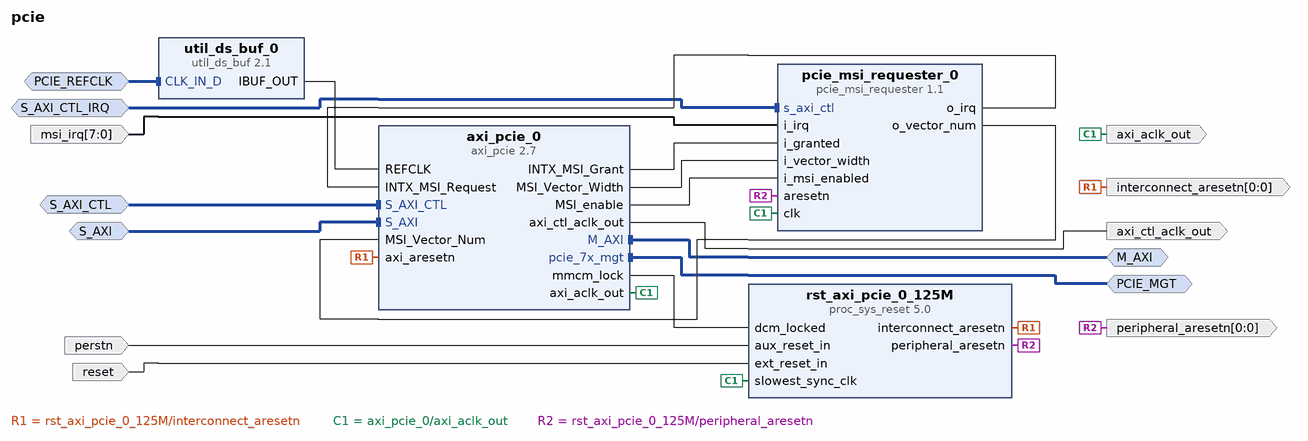
[diagram p0: block diagram of the top level]
# Vivado block design pcie, Vivado 2015.4.1
create_bd_design pcie

create_bd_intf_port -mode Slave -vlnv xilinx.com:interface:diff_clock_rtl:1.0 PCIE_REFCLK
create_bd_intf_port -mode Slave -vlnv xilinx.com:interface:aximm_rtl:1.0 S_AXI_CTL
set_property -dict [list \
  CONFIG.DATA_WIDTH 32 \
  CONFIG.PROTOCOL AXI4LITE \
  CONFIG.ID_WIDTH 0 \
  CONFIG.ADDR_WIDTH 28 \
  CONFIG.AWUSER_WIDTH 0 \
  CONFIG.ARUSER_WIDTH 0 \
  CONFIG.WUSER_WIDTH 0 \
  CONFIG.RUSER_WIDTH 0 \
  CONFIG.BUSER_WIDTH 0 \
  CONFIG.READ_WRITE_MODE READ_WRITE \
  CONFIG.HAS_BURST 0 \
  CONFIG.HAS_LOCK 0 \
  CONFIG.HAS_PROT 0 \
  CONFIG.HAS_CACHE 0 \
  CONFIG.HAS_QOS 0 \
  CONFIG.HAS_REGION 0 \
  CONFIG.HAS_WSTRB 1 \
  CONFIG.HAS_BRESP 1 \
  CONFIG.HAS_RRESP 1 \
  CONFIG.SUPPORTS_NARROW_BURST 0 \
  CONFIG.NUM_READ_OUTSTANDING 4 \
  CONFIG.NUM_WRITE_OUTSTANDING 4 \
  CONFIG.MAX_BURST_LENGTH 1 \
  CONFIG.PHASE 0.000 \
] [get_bd_intf_ports S_AXI_CTL]
create_bd_intf_port -mode Master -vlnv xilinx.com:interface:aximm_rtl:1.0 M_AXI
set_property -dict [list \
  CONFIG.DATA_WIDTH 128 \
  CONFIG.PROTOCOL AXI4 \
  CONFIG.ADDR_WIDTH 32 \
  CONFIG.HAS_QOS 0 \
  CONFIG.HAS_REGION 0 \
  CONFIG.NUM_READ_OUTSTANDING 4 \
  CONFIG.NUM_WRITE_OUTSTANDING 4 \
] [get_bd_intf_ports M_AXI]
create_bd_intf_port -mode Slave -vlnv xilinx.com:interface:aximm_rtl:1.0 S_AXI
set_property -dict [list \
  CONFIG.DATA_WIDTH 128 \
  CONFIG.PROTOCOL AXI4 \
  CONFIG.ID_WIDTH 2 \
  CONFIG.ADDR_WIDTH 32 \
  CONFIG.AWUSER_WIDTH 0 \
  CONFIG.ARUSER_WIDTH 0 \
  CONFIG.WUSER_WIDTH 0 \
  CONFIG.RUSER_WIDTH 0 \
  CONFIG.BUSER_WIDTH 0 \
  CONFIG.READ_WRITE_MODE READ_WRITE \
  CONFIG.HAS_BURST 1 \
  CONFIG.HAS_LOCK 0 \
  CONFIG.HAS_PROT 0 \
  CONFIG.HAS_CACHE 0 \
  CONFIG.HAS_QOS 0 \
  CONFIG.HAS_REGION 1 \
  CONFIG.HAS_WSTRB 1 \
  CONFIG.HAS_BRESP 1 \
  CONFIG.HAS_RRESP 1 \
  CONFIG.SUPPORTS_NARROW_BURST 1 \
  CONFIG.NUM_READ_OUTSTANDING 8 \
  CONFIG.NUM_WRITE_OUTSTANDING 2 \
  CONFIG.MAX_BURST_LENGTH 256 \
] [get_bd_intf_ports S_AXI]
create_bd_intf_port -mode Master -vlnv xilinx.com:interface:pcie_7x_mgt_rtl:1.0 PCIE_MGT
create_bd_intf_port -mode Slave -vlnv xilinx.com:interface:aximm_rtl:1.0 S_AXI_CTL_IRQ
set_property -dict [list \
  CONFIG.DATA_WIDTH 32 \
  CONFIG.PROTOCOL AXI4LITE \
  CONFIG.ID_WIDTH 0 \
  CONFIG.ADDR_WIDTH 16 \
  CONFIG.AWUSER_WIDTH 0 \
  CONFIG.ARUSER_WIDTH 0 \
  CONFIG.WUSER_WIDTH 0 \
  CONFIG.RUSER_WIDTH 0 \
  CONFIG.BUSER_WIDTH 0 \
  CONFIG.READ_WRITE_MODE READ_WRITE \
  CONFIG.HAS_BURST 0 \
  CONFIG.HAS_LOCK 0 \
  CONFIG.HAS_PROT 1 \
  CONFIG.HAS_CACHE 0 \
  CONFIG.HAS_QOS 0 \
  CONFIG.HAS_REGION 0 \
  CONFIG.HAS_WSTRB 1 \
  CONFIG.HAS_BRESP 1 \
  CONFIG.HAS_RRESP 1 \
  CONFIG.SUPPORTS_NARROW_BURST 0 \
  CONFIG.NUM_READ_OUTSTANDING 1 \
  CONFIG.NUM_WRITE_OUTSTANDING 1 \
  CONFIG.MAX_BURST_LENGTH 1 \
] [get_bd_intf_ports S_AXI_CTL_IRQ]
create_bd_port -dir O -from 0 -to 0 -type rst interconnect_aresetn
create_bd_port -dir I -type rst perstn
create_bd_port -dir O -type clk axi_aclk_out
set_property -dict [list \
  CONFIG.ASSOCIATED_BUSIF M_AXI:S_AXI:S_AXI_CTL_IRQ \
  CONFIG.ASSOCIATED_RESET peripheral_aresetn:interconnect_aresetn \
] [get_bd_ports axi_aclk_out]
create_bd_port -dir I -type rst reset
create_bd_port -dir O -from 0 -to 0 -type rst peripheral_aresetn
create_bd_port -dir I -from 7 -to 0 msi_irq
create_bd_port -dir O -type clk axi_ctl_aclk_out
set_property -dict {CONFIG.ASSOCIATED_BUSIF S_AXI_CTL} [get_bd_ports axi_ctl_aclk_out]

create_bd_cell -type ip -vlnv xilinx.com:ip:axi_pcie:2.7 axi_pcie_0
set_property -dict [list \
  CONFIG.NO_OF_LANES X4 \
  CONFIG.MAX_LINK_SPEED 5.0_GT/s \
  CONFIG.DEVICE_ID 0x7022 \
  CONFIG.ENABLE_CLASS_CODE false \
  CONFIG.CLASS_CODE 0x070101 \
  CONFIG.SUB_CLASS_INTERFACE_MENU Bi_directional_parallel_port \
  CONFIG.BAR1_ENABLED false \
  CONFIG.BAR1_TYPE N/A \
  CONFIG.BAR0_SCALE Kilobytes \
  CONFIG.BAR1_SCALE N/A \
  CONFIG.BAR0_SIZE 64 \
  CONFIG.BAR1_SIZE 8 \
  CONFIG.PCIEBAR2AXIBAR_1 0xFFFFFFFF \
  CONFIG.INTERRUPT_PIN false \
  CONFIG.NUM_MSI_REQ 3 \
  CONFIG.COMP_TIMEOUT 50ms \
  CONFIG.AXIBAR2PCIEBAR_0 0x00000000 \
  CONFIG.S_AXI_DATA_WIDTH 128 \
  CONFIG.M_AXI_DATA_WIDTH 128 \
  CONFIG.XLNX_REF_BOARD VC707 \
  CONFIG.PCIE_BLK_LOCN X1Y0 \
  CONFIG.en_transceiver_status_ports false \
] [get_bd_cells axi_pcie_0]
create_bd_cell -type ip -vlnv xilinx.com:ip:proc_sys_reset:5.0 rst_axi_pcie_0_125M
set_property -dict [list \
  CONFIG.C_AUX_RESET_HIGH 0 \
  CONFIG.C_AUX_RST_WIDTH 1 \
  CONFIG.C_EXT_RST_WIDTH 16 \
  CONFIG.USE_BOARD_FLOW true \
  CONFIG.RESET_BOARD_INTERFACE reset \
] [get_bd_cells rst_axi_pcie_0_125M]
create_bd_cell -type ip -vlnv xilinx.com:ip:util_ds_buf:2.1 util_ds_buf_0
set_property -dict {CONFIG.C_BUF_TYPE IBUFDSGTE} [get_bd_cells util_ds_buf_0]
create_bd_cell -type ip -vlnv acs.eonerc.rwth-aachen.de:user:pcie_msi_requester:1.1 pcie_msi_requester_0
set_property -dict {CONFIG.NUM_IRQS 8} [get_bd_cells pcie_msi_requester_0]

# ---- connections ----

connect_bd_intf_net -intf_net pcie_ref_1 [get_bd_intf_ports PCIE_REFCLK] [get_bd_intf_pins util_ds_buf_0/CLK_IN_D]
connect_bd_intf_net -intf_net axi_interconnect_0_M05_AXI [get_bd_intf_ports S_AXI_CTL] [get_bd_intf_pins axi_pcie_0/S_AXI_CTL]
connect_bd_intf_net [get_bd_intf_ports M_AXI] [get_bd_intf_pins axi_pcie_0/M_AXI]
connect_bd_intf_net [get_bd_intf_ports S_AXI] [get_bd_intf_pins axi_pcie_0/S_AXI]
connect_bd_intf_net [get_bd_intf_ports PCIE_MGT] [get_bd_intf_pins axi_pcie_0/pcie_7x_mgt]
connect_bd_intf_net -intf_net s_axi_ctl_1_1 [get_bd_intf_ports S_AXI_CTL_IRQ] [get_bd_intf_pins pcie_msi_requester_0/s_axi_ctl]
connect_bd_net -net S00_ARESETN_1 [get_bd_pins rst_axi_pcie_0_125M/interconnect_aresetn] \
  [get_bd_ports interconnect_aresetn] [get_bd_pins axi_pcie_0/axi_aresetn]
connect_bd_net -net aux_reset_in_1 [get_bd_ports perstn] [get_bd_pins rst_axi_pcie_0_125M/aux_reset_in]
connect_bd_net [get_bd_pins axi_pcie_0/INTX_MSI_Grant] [get_bd_pins pcie_msi_requester_0/i_granted]
connect_bd_net [get_bd_pins axi_pcie_0/MSI_Vector_Width] [get_bd_pins pcie_msi_requester_0/i_vector_width]
connect_bd_net [get_bd_pins axi_pcie_0/MSI_enable] [get_bd_pins pcie_msi_requester_0/i_msi_enabled]
connect_bd_net [get_bd_pins axi_pcie_0/axi_aclk_out] \
  [get_bd_ports axi_aclk_out] [get_bd_pins rst_axi_pcie_0_125M/slowest_sync_clk] [get_bd_pins pcie_msi_requester_0/clk]
connect_bd_net [get_bd_pins axi_pcie_0/mmcm_lock] [get_bd_pins rst_axi_pcie_0_125M/dcm_locked]
connect_bd_net [get_bd_pins pcie_msi_requester_0/o_irq] [get_bd_pins axi_pcie_0/INTX_MSI_Request]
connect_bd_net [get_bd_pins pcie_msi_requester_0/o_vector_num] [get_bd_pins axi_pcie_0/MSI_Vector_Num]
connect_bd_net [get_bd_ports reset] [get_bd_pins rst_axi_pcie_0_125M/ext_reset_in]
connect_bd_net [get_bd_pins rst_axi_pcie_0_125M/peripheral_aresetn] [get_bd_ports peripheral_aresetn] [get_bd_pins pcie_msi_requester_0/aresetn]
connect_bd_net [get_bd_pins util_ds_buf_0/IBUF_OUT] [get_bd_pins axi_pcie_0/REFCLK]
connect_bd_net -net i_irq_1 [get_bd_ports msi_irq] [get_bd_pins pcie_msi_requester_0/i_irq]
connect_bd_net [get_bd_pins axi_pcie_0/axi_ctl_aclk_out] [get_bd_ports axi_ctl_aclk_out]

# ---- address map ----
assign_bd_address -offset 0x00000000 -range 4G -target_address_space [get_bd_addr_spaces axi_pcie_0/M_AXI] [get_bd_addr_segs M_AXI/Reg]
assign_bd_address -offset 0x00000000 -range 4G -target_address_space [get_bd_addr_spaces S_AXI] [get_bd_addr_segs axi_pcie_0/S_AXI/BAR0]
assign_bd_address -offset 0x0000000 -range 256M -target_address_space [get_bd_addr_spaces S_AXI_CTL] [get_bd_addr_segs axi_pcie_0/S_AXI_CTL/CTL0]
assign_bd_address -offset 0x0000 -range 64K -target_address_space [get_bd_addr_spaces S_AXI_CTL_IRQ] [get_bd_addr_segs pcie_msi_requester_0/s_axi_ctl/Reg]

validate_bd_design
save_bd_design
